# EAGLE design nodemcu 1 meter (EAGLE 9.6.2)
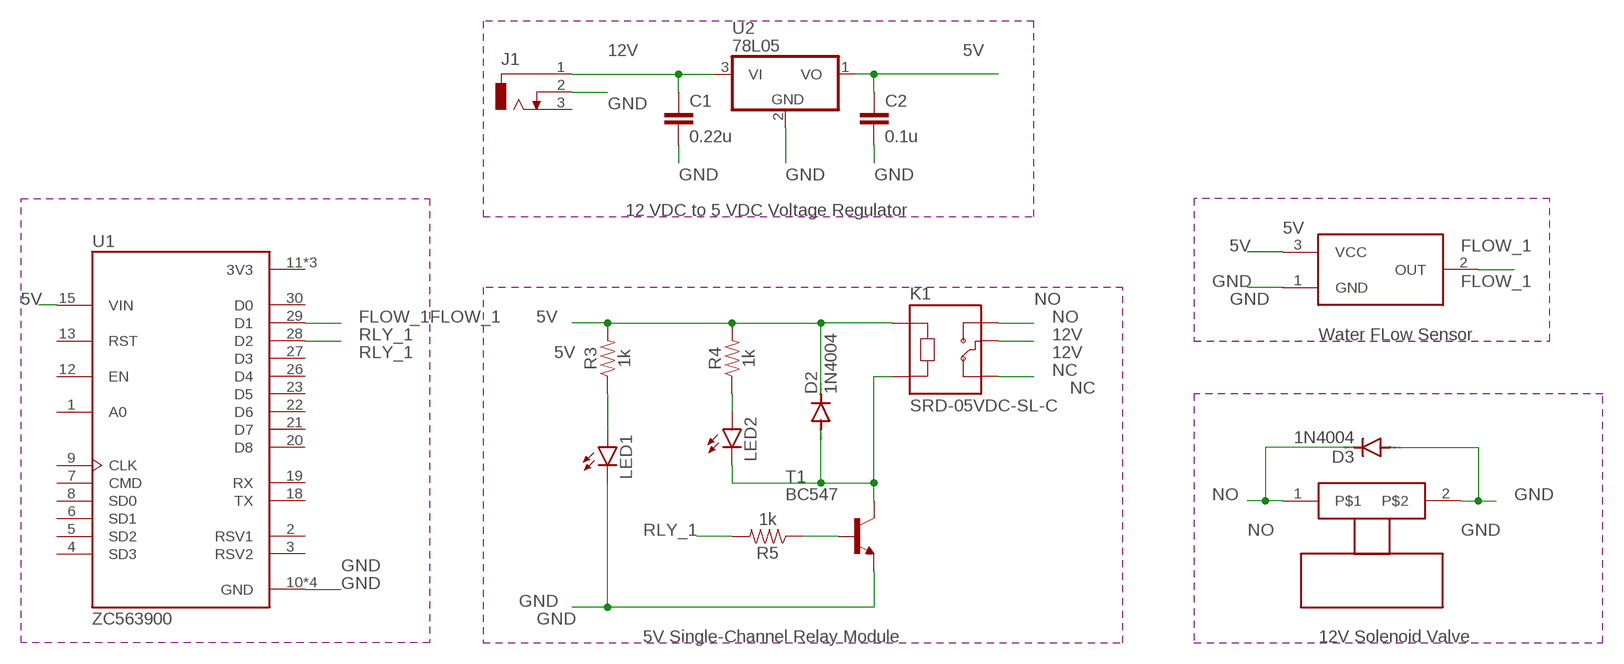
[diagram p0: schematic, sheet 1]

## Parts
C1  0.22u  C-EU025-025X050  [C025-025X050]
C2  0.1u  C-EU025-025X050  [C025-025X050]
D2  1N4004  [DO41-10]
D3  1N4004  [DO41-10]
FLOWSENSOR1  FLOWSENSOR  [FLOWSENSOR]
J1  DCJ0303  [DCJ0303]
K1  SRD-05VDC-SL-C  [RELAY_SRD-05VDC-SL-C]
LED1  LED3MM  [LED3MM]
LED2  LED3MM  [LED3MM]
R3  1k  1KOHM-HORIZ-1/4W-1%  [AXIAL-0.3]
R4  1k  1KOHM-HORIZ-1/4W-1%  [AXIAL-0.3]
R5  1k  1KOHM-HORIZ-1/4W-1%  [AXIAL-0.3]
T1  BC547  [TO92]
U1  ZC563900  [MODULE_ZC563900]
U2  78L05  78LXXZ  [TO92]
VALVE1  SOLENOID-VALVESOLENOID-CONNECTOR  [332-02]

## Nets
5V: C2.2 D2.C FLOWSENSOR1.3(VCC) K1.A1 R3.P$2 R4.P$2 U1.15(VIN) U2.1(VO)
12V: C1.2 J1.1 K1.COM U2.3(VI)
FLOW_1: FLOWSENSOR1.2(OUT) U1.29(D1)
GND: C1.1 C2.1 D3.A FLOWSENSOR1.1(GND) J1.2 LED1.K(C) T1.1(E) U1.10(GND) U1.14(GND) U1.17(GND) U1.24(GND) U2.2(GND) VALVE1.2
N$2: R5.P$1 T1.2(B)
N$8: D2.A K1.A2 LED2.K(C) T1.3(C)
N$10: LED2.A R4.P$1
N$12: LED1.A R3.P$1
NC: K1.NC
NO: D3.C K1.NO VALVE1.1
RLY_1: R5.P$2 U1.28(D2)
Unconnected: J1.3 U1.1(A0) U1.2(RSV1) U1.3(RSV2) U1.4(SD3) U1.5(SD2) U1.6(SD1) U1.7(CMD) U1.8(SD0) U1.9(CLK) U1.12(EN) U1.13(RST) U1.18(TX) U1.19(RX) U1.20(D8) U1.21(D7) U1.22(D6) U1.23(D5) U1.26(D4) U1.27(D3) U1.30(D0)

## Notes on the sheet
- 12 VDC to 5 VDC Voltage Regulator
- Water FLow Sensor
- 5V Single-Channel Relay Module | 12V Solenoid Valve

## Power pins joined to a net without a drawn wire
3V3: U1.11(3V3) U1.16(3V3) U1.25(3V3)

## Library data of the parts
C1 C2 = rcl:C-EU: Capacitor EUrop Symbol
D2 D3 = diode:1N4004: DIODE general purpose rectifier, 1 A
FLOWSENSOR1 = flow-sensor:FLOWSENSOR
J1 = con-jack:DCJ0303: DC POWER JACK Source: DCJ0303.pdf; OC_FARNELL: unknown; OC_NEWARK: unknown
K1 = SRD-05VDC-SL-C:SRD-05VDC-SL-C: 5V Trigger Relay Module For Arduino And Raspberry Pi 5V Trigger Relay Module For Arduino And Raspberry Pi Check prices <https://pricing.snapeda.com/parts/SRD-05VDC-SL-C/Songle%20Relay/view-part?ref=eda>; AVAILABILITY: Not in stock; DESCRIPTION: 5V Trigger Relay Module For Arduino And Raspberry Pi 5V Trigger Relay Module For Arduino And Raspberry Pi; MF: Songle Relay; MP: SRD-05VDC-SL-C; PACKAGE: None; PRICE: None
LED1 LED2 = led:LED: LED OSRAM: - CHIPLED LG R971, LG N971, LY N971, LG Q971, LY Q971, LO R971, LY R971 LH N974, LH R974 LS Q976, LO Q976, LY Q976 LO Q996 - Hyper CHIPLED LW Q18S LB Q993, LB Q99A, LB R99A - SideLED LS A670, LO A670, LY A670, LG A670, LP A670 LB A673, LV A673, LT A673, LW A673 LH A674 LY A675 LS A676, LA A676, LO A676, LY A676, LW A676 LS A679, LY A679, LG A679 - Hyper Micro SIDELED® LS Y876, LA Y876, LO Y876, LY Y876 LT Y87S - SmartLED LW L88C, LW L88S LB L89C, LB L89S, LG L890 LS L89K, LO L89K, LY L89K LS L896, LA L896, LO L896, LY L896 - TOPLED LS T670, LO T670, LY T670, LG T670, LP T670 LSG T670, LSP T670, LSY T670, LOP T670, LYG T670 LG T671, LOG T671, LSG T671 LB T673, LV T673, LT T673, LW T673 LH T674 LS T676, LA T676, LO T676, LY T676, LB T676, LH T676, LSB T676, LW T676 LB T67C, LV T67C, LT T67C, LS T67K, LO T67K, LY T67K, LW E67C LS E67B, LA E67B, LO E67B, LY E67B, LB E67C, LV E67C, LT E67C LW T67C LS T679, LY T679, LG T679 LS T770, LO T770, LY T770, LG T770, LP T770 LB T773, LV T773, LT T773, LW T773 LH T774 LS E675, LA E675, LY E675, LS T675 LS T776, LA T776, LO T776, LY T776, LB T776 LHGB T686 LT T68C, LB T68C - Hyper Mini TOPLED® LB M676 - Mini TOPLED Santana® LG M470 LS M47K, LO M47K, LY M47K Source: http://www.osram.convergy.de LUXEON: - LUMILED® LXK2-PW12-R00, LXK2-PW12-S00, LXK2-PW14-U00, LXK2-PW14-V00 LXK2-PM12-R00, LXK2-PM12-S00, LXK2-PM14-U00 LXK2-PE12-Q00, LXK2-PE12-R00, LXK2-PE12-S00, LXK2-PE14-T00, LXK2-PE14-U00 LXK2-PB12-K00, LXK2-PB12-L00, LXK2-PB12-M00, LXK2-PB14-N00, LXK2-PB14-P00, LXK2-PB14-Q00 LXK2-PR12-L00, LXK2-PR12-M00, LXK2-PR14-Q00, LXK2-PR14-R00 LXK2-PD12-Q00, LXK2-PD12-R00, LXK2-PD12-S00 LXK2-PH12-R00, LXK2-PH12-S00 LXK2-PL12-P00, LXK2-PL12-Q00, LXK2-PL12-R00 Source: www.luxeon.com KINGBRIGHT: KA-3528ASYC Source: www.kingbright.com
R3-R5 = SparkFun-Resistors:1KOHM: 1kΩ resistor A resistor is a passive two-terminal electrical component that implements electrical resistance as a circuit element. Resistors act to reduce current flow, and, at the same time, act to lower voltage levels within circuits. - Wikipedia; PROD_ID: RES-12182
T1 = transistor:BC547: NPN TRANSISTOR
U1 = ZC563900:ZC563900: NodeMcu Lua ESP8266 WIFI Internet of Things Network Development Module Board Check prices <https://pricing.snapeda.com/parts/ZC563900/YKS/view-part?ref=eda>; AVAILABILITY: Not in stock; DESCRIPTION: NodeMcu Lua ESP8266 WIFI Internet of Things Network Development Module Board; MF: YKS; MP: ZC563900; PACKAGE: None; PRICE: None
U2 = linear:78LXXZ: V-Reg. positiv voltage regulator / low power TO92
VALVE1 = Solenoid-valve:SOLENOID-VALVE

## Board
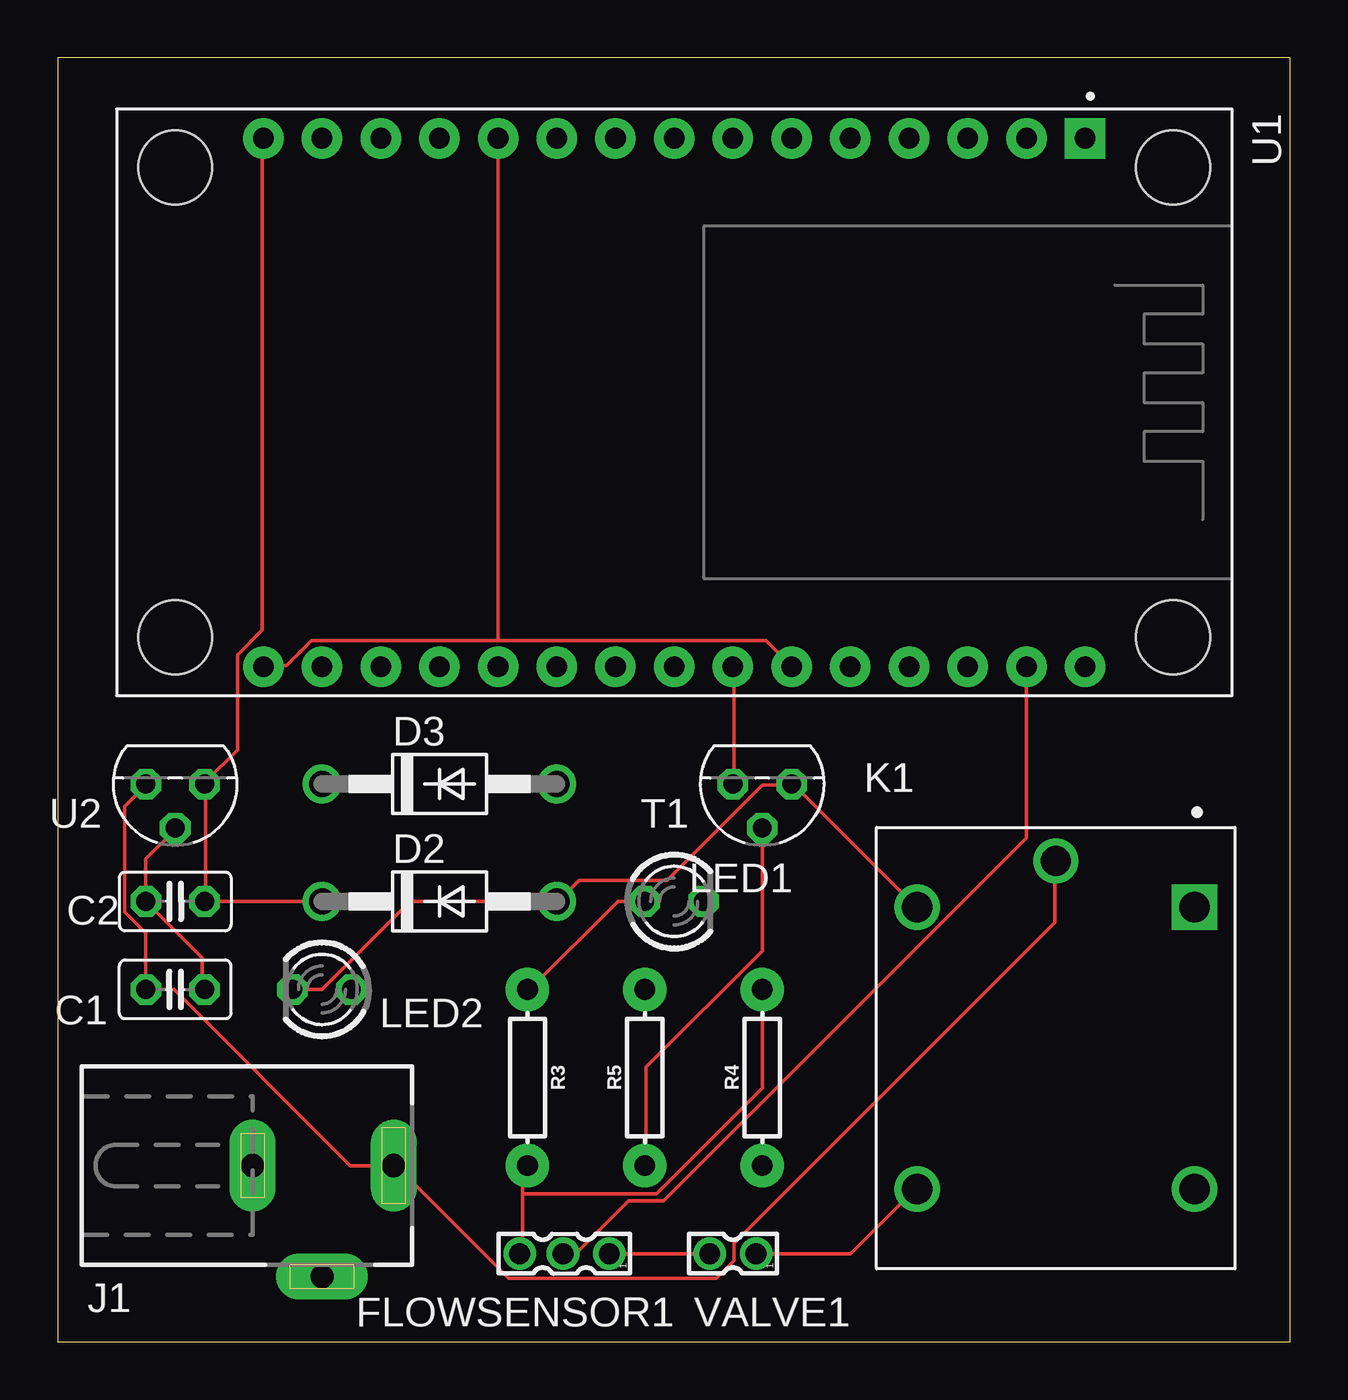
[diagram p1: board, top side]
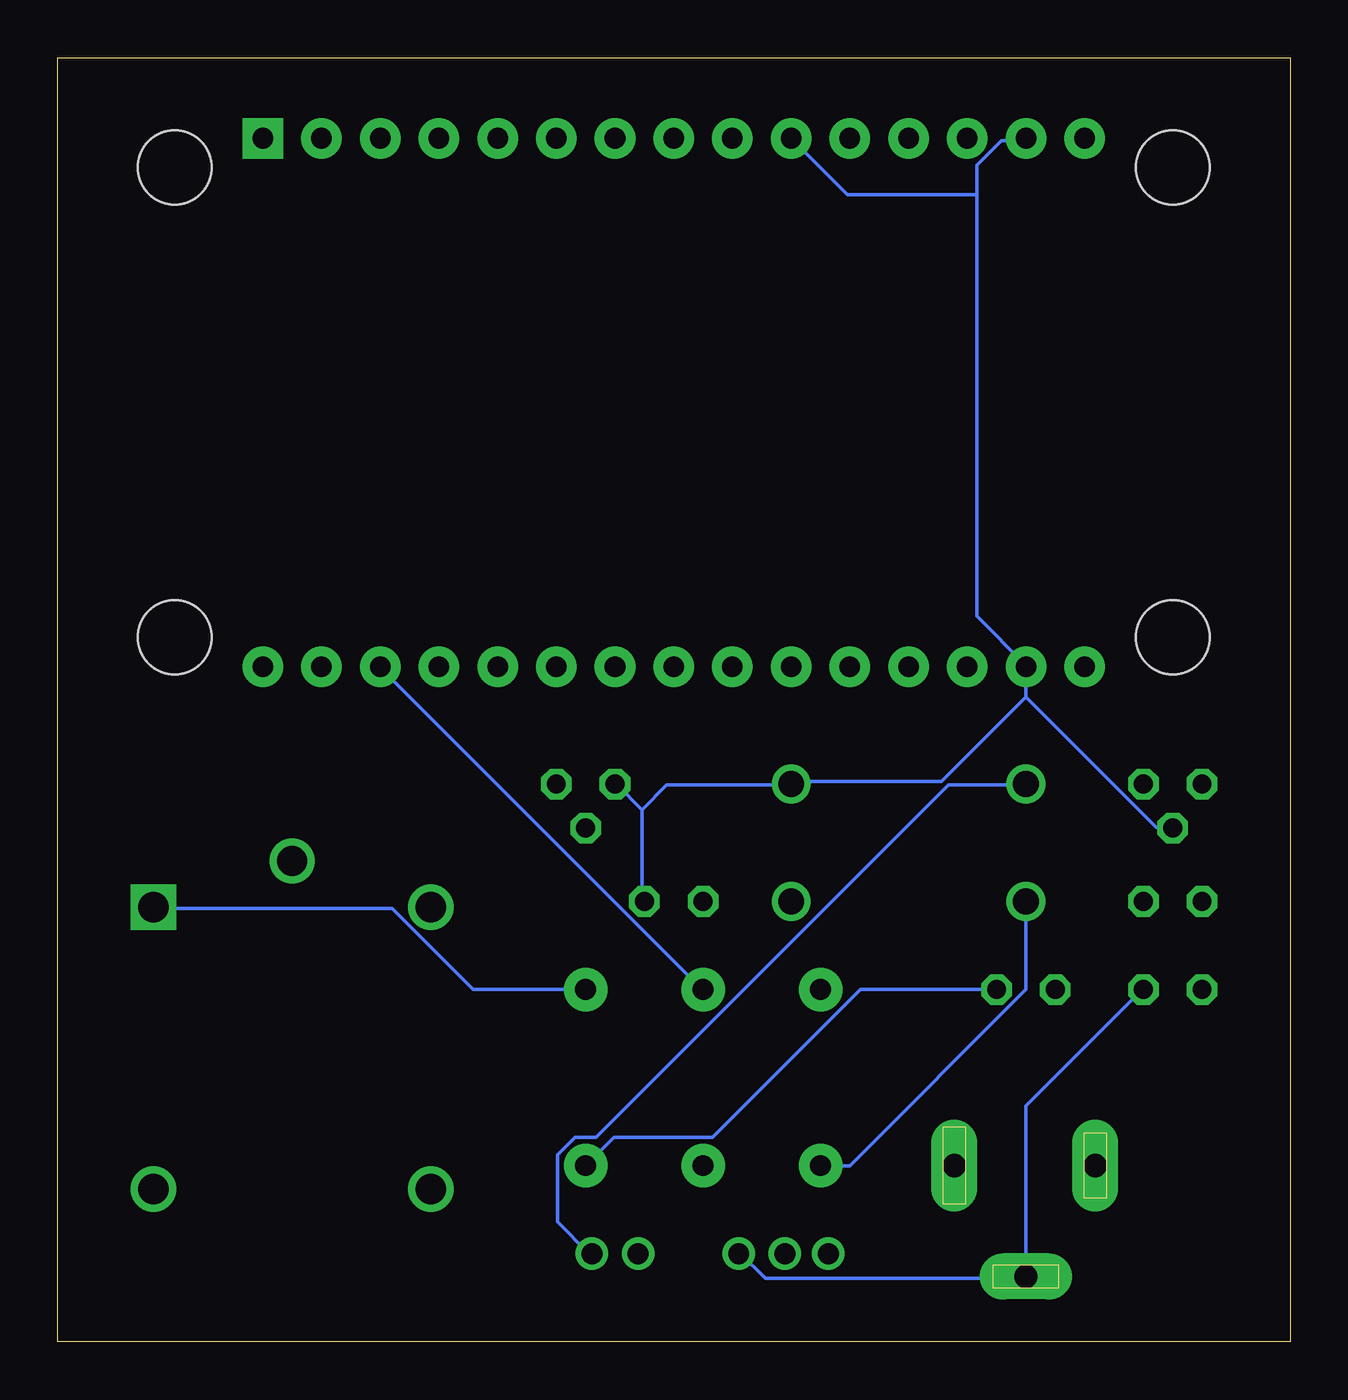
[diagram p2: board, bottom side, seen from below]

Size 53.32 x 55.55 mm. Coordinates in mm from the lower left corner, seen from the top.
Outline: 0,0 53.32,0 53.32,55.55 0,55.55 0,0
Copper layers (1*16): Top 0.035mm / dielectric 1.5mm / Bottom 0.035mm
Design rules "default": minimum track width 6mil, minimum drill 0.35mm, track to track 6mil, track to pad 6mil, pad to pad 6mil, via to via 6mil, smd to smd 6mil, copper to edge 40mil, drill to drill 6mil, minimum pad ring 10mil, minimum via ring 8mil, stop-mask expansion 4mil, vias tented up to drill 0mil, thermal gap 10mil

### Footprints (pad centres in the part's own frame; a part is rotated, then mirrored left to right if it is on the bottom)
C025-025X050 = drill 0.813 octagon: 1 -1.27,0; 2 1.27,0
DO41-10 = drill 1.118: A 5.08,0; C -5.08,0
FLOWSENSOR = drill 0.9 pad 1.27: 1 0,-1; 2 0,1; 3 0,2.88
DCJ0303 = drill 1 pad 2 long: 1 0,3.1; 2 4.8,0; 3 0,-3
RELAY_SRD-05VDC-SL-C = drill 1.32 square: A1 -6.1,6 | drill 1.32: A2 -6.1,-6; NC 6.1,6; NO 6.1,-6 | drill 1.29: COM -8.1,0
LED3MM = drill 0.813 octagon: A -1.27,0; K 1.27,0
AXIAL-0.3 = drill 0.9 pad 1.88: P$1 -3.81,0; P$2 3.81,0
TO92 = drill 0.813 octagon: 1 1.27,0; 2 0,1.905; 3 -1.27,0
MODULE_ZC563900 = drill 0.889 pad 1.753 square: 1 -11.43,17.78 | drill 0.889 pad 1.753: 2 -11.43,15.24; 3 -11.43,12.7; 4 -11.43,10.16; 5 -11.43,7.62; 6 -11.43,5.08; 7 -11.43,2.54; 8 -11.43,0; 9 -11.43,-2.54; 10 -11.43,-5.08; 11 -11.43,-7.62; 12 -11.43,-10.16; 13 -11.43,-12.7; 14 -11.43,-15.24; 15 -11.43,-17.78; 16 11.43,-17.78; 17 11.43,-15.24; 18 11.43,-12.7; 19 11.43,-10.16; 20 11.43,-7.62; 21 11.43,-5.08; 22 11.43,-2.54; 23 11.43,0; 24 11.43,2.54; 25 11.43,5.08; 26 11.43,7.62; 27 11.43,10.16; 28 11.43,12.7; 29 11.43,15.24; 30 11.43,17.78 | hole 3.2: -10.16,21.59; 10.16,21.59; 10.16,-21.59; -10.16,-21.59
TO92' = drill 0.813 octagon: 1 -1.27,0; 2 0,1.905; 3 1.27,0
332-02 = drill 0.9 pad 1.27: 1 0,-1; 2 0,1

### Placement (x,y rotation side)
C1  5.08,15.24 180 top
C2  5.08,19.05 0 top
D2  16.51,19.05 0 top
D3  16.51,24.13 0 top
FLOWSENSOR1  22.86,3.81 90 top
J1  11.43,7.62 270 top
K1  43.18,12.7 270 top
LED1  26.67,19.05 0 top
LED2  11.43,15.24 180 top
R3  20.32,11.43 270 top
R4  30.48,11.43 90 top
R5  25.4,11.43 90 top
T1  30.48,24.13 180 top
U1  26.67,40.64 270 top
U2  78L05  [TO92']  5.08,24.13 180 top
VALVE1  29.21,3.81 90 top

### Tracks (layer width: path | path; a pad name or v marks a point on that pad's centre or on a via)
3V3
  Top 0.152: 19.05,30.33 30.63,30.33 U1.25 | 19.05,30.33 10.97,30.33 9.91,29.26 8.99,29.26 U1.16 | 19.05,30.33 U1.11
5V
  Top 0.152: 6.4,19.05 6.4,24.08 U2.1 6.4,24.23 7.77,25.6 7.77,29.72 8.84,30.79 8.84,51.97 U1.15 | 6.4,19.05 D2.C | 6.4,19.05 C2.2 | 20.12,6.4 20.12,7.47 20.27,7.62 R3.P$2 | 20.12,6.4 20.12,3.81 FLOWSENSOR1.3 | R4.P$2 30.48,10.97 25.91,6.4 20.12,6.4
  Bottom 0.152: R4.P$2 35.36,15.24 38.86,18.75 49.07,18.75 K1.A1 | D2.C 11.43,15.24 19.05,7.62 R3.P$2
12V
  Top 0.152: U2.3 3.81,24.08 2.9,23.16 2.9,18.59 3.81,17.68 C1.2 5.03,15.24 12.65,7.62 J1.1 14.63,7.62 19.51,2.74 28.5,2.74 29.26,3.5 29.26,4.27 43.13,18.14 43.13,20.73 K1.COM
FLOW_1
  Top 0.152: FLOWSENSOR1.2 22.4,3.81 24.69,6.1 26.21,6.1 41.91,21.79 U1.29
GND
  Top 0.152: VALVE1.2 FLOWSENSOR1.1 | U1.24 29.26,29.11 29.26,24.23 T1.1 | U2.2 5.03,22.1 3.81,20.88 C2.1 6.25,16.61 6.25,15.24 C1.1
  Bottom 0.152: FLOWSENSOR1.1 23.77,3.81 22.71,2.74 11.43,2.74 J1.2 11.43,10.21 6.4,15.24 C1.1 | 28.04,23.01 28.04,19.05 LED1.K | 28.04,23.01 29.11,24.08 T1.1 | 28.04,23.01 26.98,24.08 21.64,24.08 D3.A 21.49,24.23 15.09,24.23 11.43,27.89 | 13.56,49.63 19.15,49.63 U1.10 | U1.14 11.43,51.97 12.5,51.97 13.56,50.9 13.56,49.63 | 11.43,27.89 U1.17 11.43,29.26 13.56,31.39 13.56,49.63 | 11.43,27.89 5.79,22.25 5.18,22.25 U2.2
N$2
  Top 0.152: T1.2 30.48,16.92 25.45,11.89 25.45,7.62 R5.P$1
N$8
  Top 0.152: K1.A2 37.03,18.9 31.85,24.08 T1.3 31.7,24.08 30.48,24.08 26.36,19.96 22.55,19.96 21.64,19.05 D2.A 15.24,19.05 11.43,15.24 LED2.K
N$10
  Bottom 0.152: LED2.A 18.59,15.24 24.99,8.84 29.26,8.84 R4.P$1
N$12
  Top 0.152: LED1.A 24.23,19.05 20.42,15.24 R3.P$1
NO
  Top 0.152: VALVE1.1 34.29,3.81 37.03,6.55 K1.NO
  Bottom 0.152: D3.C 11.43,24.08 14.78,24.08 30.02,8.84 30.94,8.84 31.7,8.08 31.7,5.18 30.33,3.81 VALVE1.1
RLY_1
  Bottom 0.152: U1.28 39.32,29.11 25.45,15.24 R5.P$2